# EAGLE board Mem Switch V1.0 (EAGLE 9.6.2)
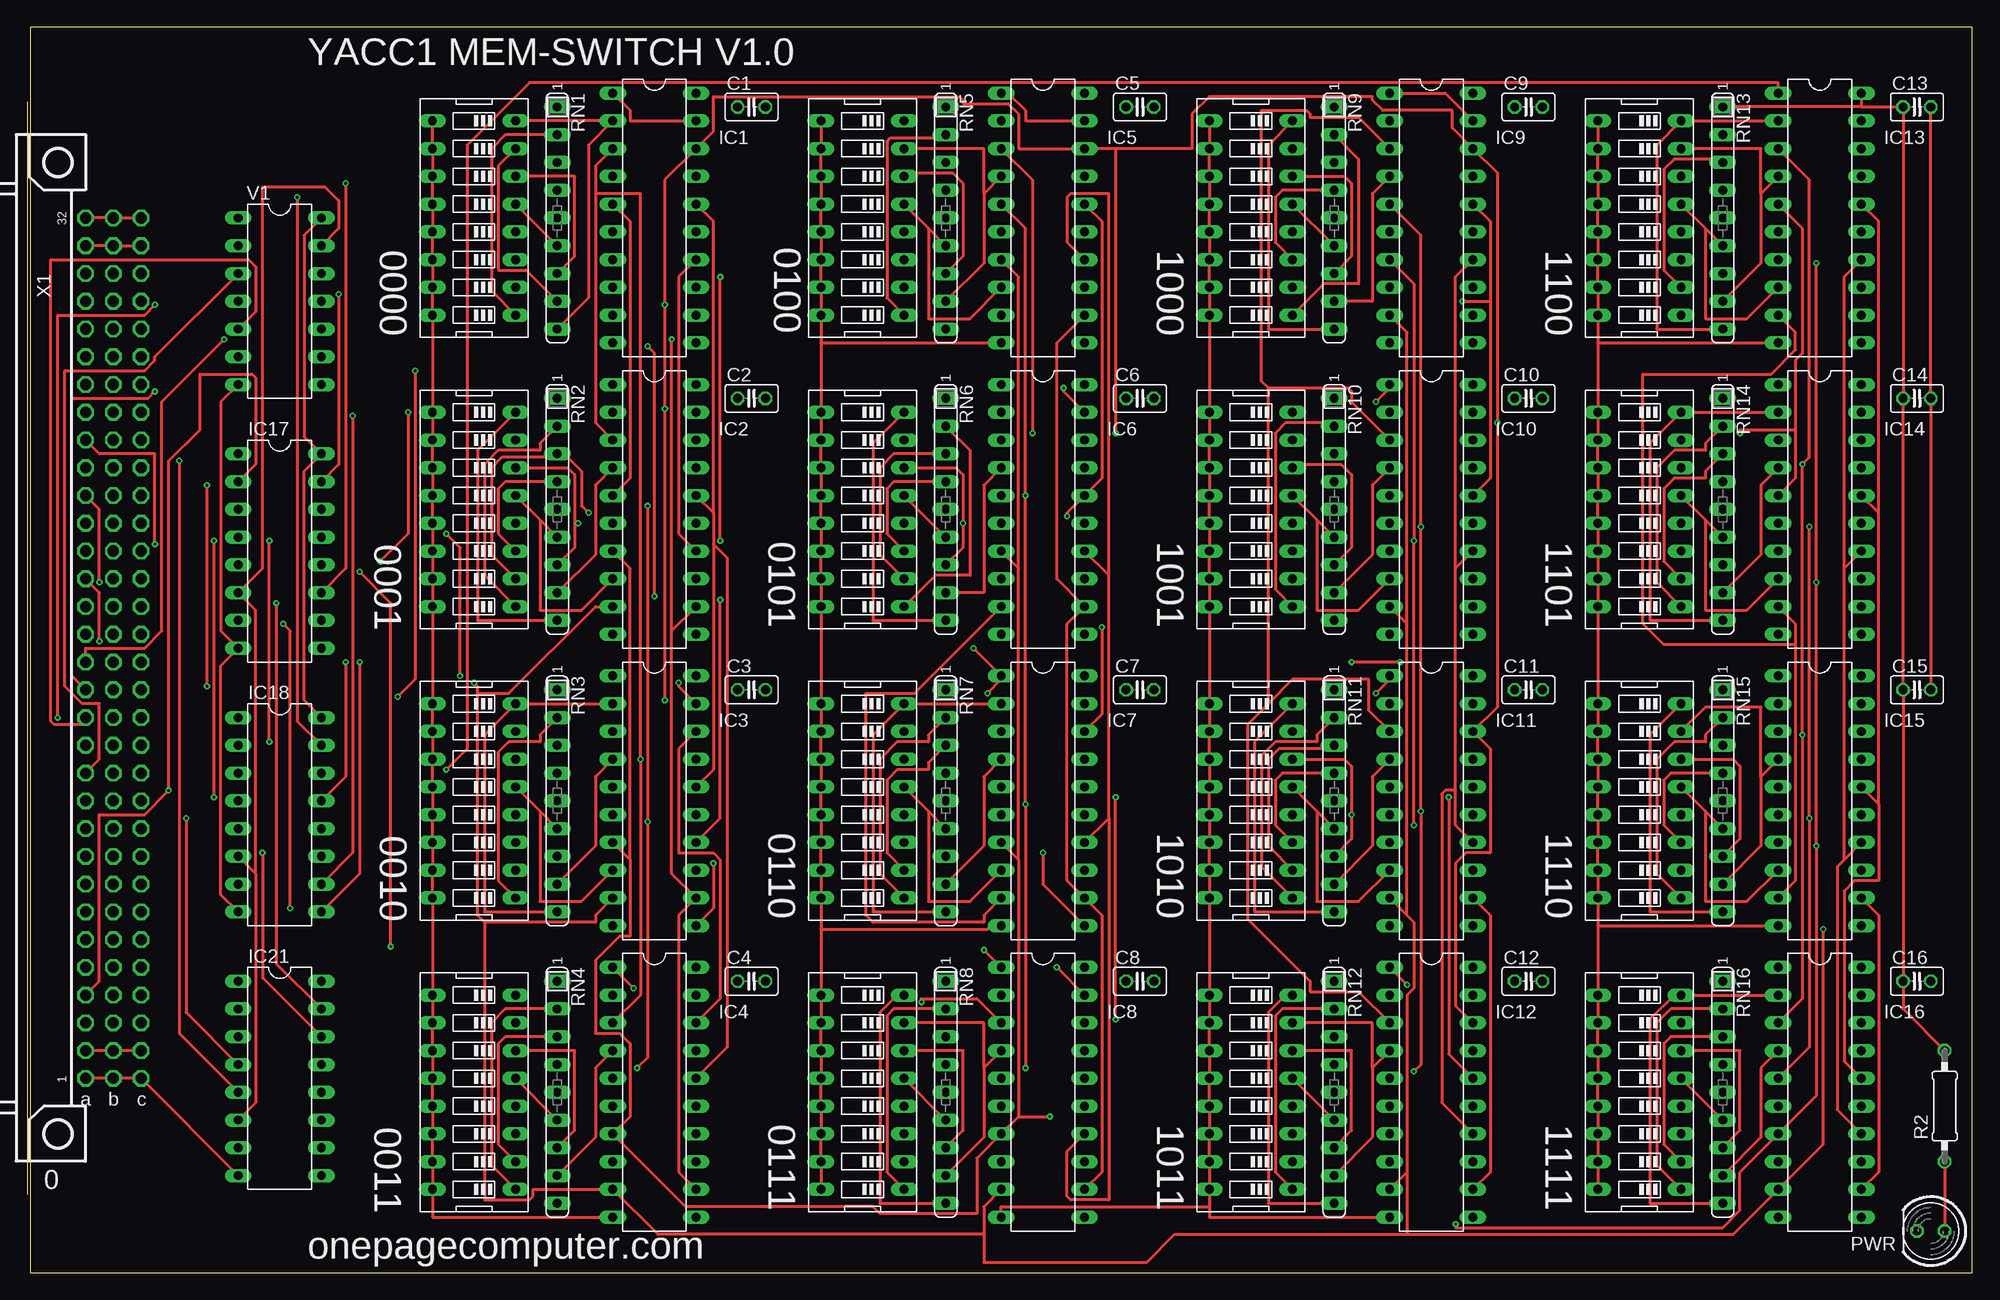
[diagram p3: board, top side]
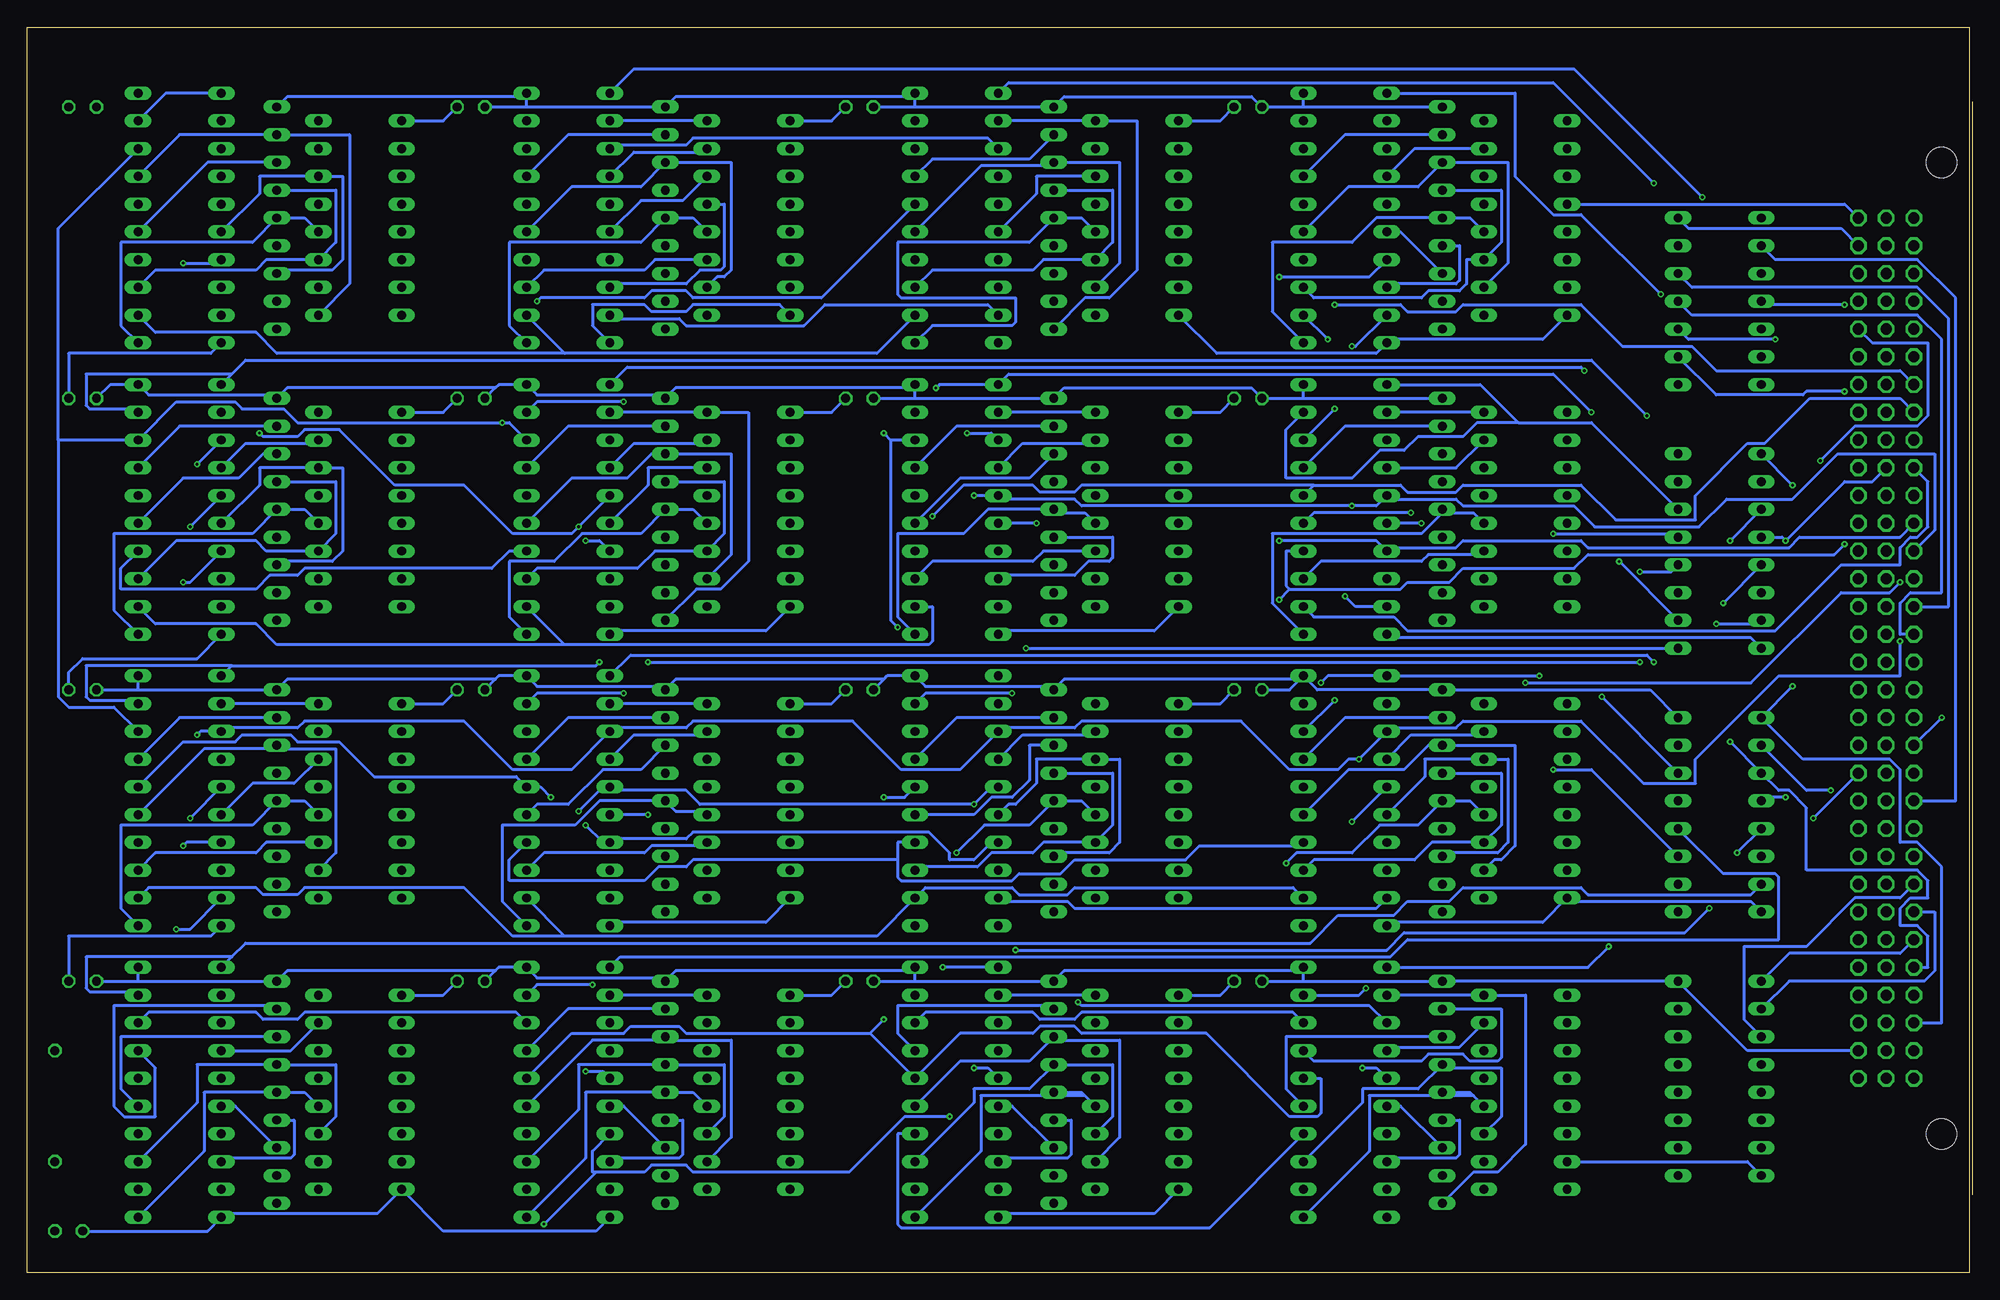
[diagram p4: board, bottom side, seen from below]

Size 177.78 x 113.97 mm. Coordinates in mm from the lower left corner, seen from the top.
Outline: 0,0 177.78,0 177.78,113.97 0,113.97 0,0
Copper layers (1*16): Top 0.035559375mm / dielectric 1.6mm / Bottom 0.035559375mm
Design rules "oshpark-2layer-auto-routing": minimum track width 10mil, minimum drill 10mil, track to track 10mil, track to pad 8mil, pad to pad 8mil, via to via 8mil, smd to smd 6mil, copper to edge 15mil, drill to drill 6mil, minimum pad ring 6mil, minimum via ring 6mil, stop-mask expansion 2.5mil, vias tented up to drill 0mil, thermal gap 10mil
Net classes: 1 GND: width 1 mm; 2 5V: width 1 mm

## Footprints (pad centres in the part's own frame; a part is rotated, then mirrored left to right if it is on the bottom)
EDG-08 = drill 0.813 long: 1 -8.89,-3.81; 2 -6.35,-3.81; 3 -3.81,-3.81; 4 -1.27,-3.81; 5 1.27,-3.81; 6 3.81,-3.81; 7 6.35,-3.81; 8 8.89,-3.81; 9 8.89,3.81; 10 6.35,3.81; 11 3.81,3.81; 12 1.27,3.81; 13 -1.27,3.81; 14 -3.81,3.81; 15 -6.35,3.81; 16 -8.89,3.81
C025-025X050 = drill 0.813 octagon: 1 -1.27,0; 2 1.27,0
DIL20 = drill 0.813 long: 1 -11.43,-3.81; 2 -8.89,-3.81; 3 -6.35,-3.81; 4 -3.81,-3.81; 5 -1.27,-3.81; 6 1.27,-3.81; 7 3.81,-3.81; 8 6.35,-3.81; 9 8.89,-3.81; 10 11.43,-3.81; 11 11.43,3.81; 12 8.89,3.81; 13 6.35,3.81; 14 3.81,3.81; 15 1.27,3.81; 16 -1.27,3.81; 17 -3.81,3.81; 18 -6.35,3.81; 19 -8.89,3.81; 20 -11.43,3.81
DIL16 = drill 0.813 long: 1 -8.89,-3.81; 2 -6.35,-3.81; 3 -3.81,-3.81; 4 -1.27,-3.81; 5 1.27,-3.81; 6 3.81,-3.81; 7 6.35,-3.81; 8 8.89,-3.81; 9 8.89,3.81; 10 6.35,3.81; 11 3.81,3.81; 12 1.27,3.81; 13 -1.27,3.81; 14 -3.81,3.81; 15 -6.35,3.81; 16 -8.89,3.81
LED5MM = drill 0.813 octagon: A -1.27,0; K 1.27,0
0207/10 = drill 0.813 octagon: 1 -5.08,0; 2 5.08,0
SIL9 = drill 0.813 long: 1 -10.16,0; 2 -7.62,0; 3 -5.08,0; 4 -2.54,0; 5 0,0; 6 2.54,0; 7 5.08,0; 8 7.62,0; 9 10.16,0
DIL14 = drill 0.813 long: 1 -7.62,-3.81; 2 -5.08,-3.81; 3 -2.54,-3.81; 4 0,-3.81; 5 2.54,-3.81; 6 5.08,-3.81; 7 7.62,-3.81; 8 7.62,3.81; 9 5.08,3.81; 10 2.54,3.81; 11 0,3.81; 12 -2.54,3.81; 13 -5.08,3.81; 14 -7.62,3.81
FABC96R = drill 1.016 octagon: A1 -2.54,39.37; A2 -2.54,36.83; A3 -2.54,34.29; A4 -2.54,31.75; A5 -2.54,29.21; A6 -2.54,26.67; A7 -2.54,24.13; A8 -2.54,21.59; A9 -2.54,19.05; A10 -2.54,16.51; A11 -2.54,13.97; A12 -2.54,11.43; A13 -2.54,8.89; A14 -2.54,6.35; A15 -2.54,3.81; A16 -2.54,1.27; A17 -2.54,-1.27; A18 -2.54,-3.81; A19 -2.54,-6.35; A20 -2.54,-8.89; A21 -2.54,-11.43; A22 -2.54,-13.97; A23 -2.54,-16.51; A24 -2.54,-19.05; A25 -2.54,-21.59; A26 -2.54,-24.13; A27 -2.54,-26.67; A28 -2.54,-29.21; A29 -2.54,-31.75; A30 -2.54,-34.29; A31 -2.54,-36.83; A32 -2.54,-39.37; B1 -5.08,39.37; B2 -5.08,36.83; B3 -5.08,34.29; B4 -5.08,31.75; B5 -5.08,29.21; B6 -5.08,26.67; B7 -5.08,24.13; B8 -5.08,21.59; B9 -5.08,19.05; B10 -5.08,16.51; B11 -5.08,13.97; B12 -5.08,11.43; B13 -5.08,8.89; B14 -5.08,6.35; B15 -5.08,3.81; B16 -5.08,1.27; B17 -5.08,-1.27; B18 -5.08,-3.81; B19 -5.08,-6.35; B20 -5.08,-8.89; B21 -5.08,-11.43; B22 -5.08,-13.97; B23 -5.08,-16.51; B24 -5.08,-19.05; B25 -5.08,-21.59; B26 -5.08,-24.13; B27 -5.08,-26.67; B28 -5.08,-29.21; B29 -5.08,-31.75; B30 -5.08,-34.29; B31 -5.08,-36.83; B32 -5.08,-39.37; C1 -7.62,39.37; C2 -7.62,36.83; C3 -7.62,34.29; C4 -7.62,31.75; C5 -7.62,29.21; C6 -7.62,26.67; C7 -7.62,24.13; C8 -7.62,21.59; C9 -7.62,19.05; C10 -7.62,16.51; C11 -7.62,13.97; C12 -7.62,11.43; C13 -7.62,8.89; C14 -7.62,6.35; C15 -7.62,3.81; C16 -7.62,1.27; C17 -7.62,-1.27; C18 -7.62,-3.81; C19 -7.62,-6.35; C20 -7.62,-8.89; C21 -7.62,-11.43; C22 -7.62,-13.97; C23 -7.62,-16.51; C24 -7.62,-19.05; C25 -7.62,-21.59; C26 -7.62,-24.13; C27 -7.62,-26.67; C28 -7.62,-29.21; C29 -7.62,-31.75; C30 -7.62,-34.29; C31 -7.62,-36.83; C32 -7.62,-39.37 | hole 2.794: 0,-44.456; 0,44.456

## Placement (x,y rotation side)
0000  [EDG-08]  40.64,96.52 90 top
0001  [EDG-08]  40.64,69.85 90 top
0010  [EDG-08]  40.64,43.18 90 top
0011  [EDG-08]  40.64,16.51 90 top
0100  [EDG-08]  76.2,96.52 90 top
0101  [EDG-08]  76.2,69.85 90 top
0110  [EDG-08]  76.2,43.18 90 top
0111  [EDG-08]  76.2,16.51 90 top
1000  [EDG-08]  111.76,96.52 90 top
1001  [EDG-08]  111.76,69.85 90 top
1010  [EDG-08]  111.76,43.18 90 top
1011  [EDG-08]  111.76,16.51 90 top
1100  [EDG-08]  147.32,96.52 90 top
1101  [EDG-08]  147.32,69.85 90 top
1110  [EDG-08]  147.32,43.18 90 top
1111  [EDG-08]  147.32,16.51 90 top
C1  [C025-025X050]  66.04,106.68 0 top
C2  [C025-025X050]  66.04,80.01 0 top
C3  [C025-025X050]  66.04,53.34 0 top
C4  [C025-025X050]  66.04,26.67 0 top
C5  [C025-025X050]  101.6,106.68 0 top
C6  [C025-025X050]  101.6,80.01 0 top
C7  [C025-025X050]  101.6,53.34 0 top
C8  [C025-025X050]  101.6,26.67 0 top
C9  [C025-025X050]  137.16,106.68 0 top
C10  [C025-025X050]  137.16,80.01 0 top
C11  [C025-025X050]  137.16,53.34 0 top
C12  [C025-025X050]  137.16,26.67 0 top
C13  [C025-025X050]  172.72,106.68 0 top
C14  [C025-025X050]  172.72,80.01 0 top
C15  [C025-025X050]  172.72,53.34 0 top
C16  [C025-025X050]  172.72,26.67 0 top
IC1  74LS244N  [DIL20]  57.15,96.52 270 top
IC2  74LS244N  [DIL20]  57.15,69.85 270 top
IC3  74LS244N  [DIL20]  57.15,43.18 270 top
IC4  74LS244N  [DIL20]  57.15,16.51 270 top
IC5  74LS244N  [DIL20]  92.71,96.52 270 top
IC6  74LS244N  [DIL20]  92.71,69.85 270 top
IC7  74LS244N  [DIL20]  92.71,43.18 270 top
IC8  74LS244N  [DIL20]  92.71,16.51 270 top
IC9  74LS244N  [DIL20]  128.27,96.52 270 top
IC10  74LS244N  [DIL20]  128.27,69.85 270 top
IC11  74LS244N  [DIL20]  128.27,43.18 270 top
IC12  74LS244N  [DIL20]  128.27,16.51 270 top
IC13  74LS244N  [DIL20]  163.83,96.52 270 top
IC14  74LS244N  [DIL20]  163.83,69.85 270 top
IC15  74LS244N  [DIL20]  163.83,43.18 270 top
IC16  74LS244N  [DIL20]  163.83,16.51 270 top
IC17  74LS138N  [DIL16]  22.86,66.04 270 top
IC18  74LS138N  [DIL16]  22.86,41.91 270 top
IC21  74LS138N  [DIL16]  22.86,17.78 270 top
PWR  [LED5MM]  173.99,3.81 180 top
R2  330  [0207/10]  175.26,15.24 90 top
RN1  [SIL9]  48.26,96.52 270 top
RN2  [SIL9]  48.26,69.85 270 top
RN3  [SIL9]  48.26,43.18 270 top
RN4  [SIL9]  48.26,16.51 270 top
RN5  [SIL9]  83.82,96.52 270 top
RN6  [SIL9]  83.82,69.85 270 top
RN7  [SIL9]  83.82,43.18 270 top
RN8  [SIL9]  83.82,16.51 270 top
RN9  [SIL9]  119.38,96.52 270 top
RN10  [SIL9]  119.38,69.85 270 top
RN11  [SIL9]  119.38,43.18 270 top
RN12  [SIL9]  119.38,16.51 270 top
RN13  [SIL9]  154.94,96.52 270 top
RN14  [SIL9]  154.94,69.85 270 top
RN15  [SIL9]  154.94,43.18 270 top
RN16  [SIL9]  154.94,16.51 270 top
V1  744078N  [DIL14]  22.86,88.9 270 top
X1  FABC96R  [FABC96R]  2.54,57.15 180 top

## Tracks (layer width: path | path; a pad name or v marks a point on that pad's centre or on a via)
-BUS-EN  (via drill 0.25)
  Top 0.254: IC21.5 13.65,21.91 v13.65,74.3
  Bottom 0.254: v13.65,74.3 10.48,77.47 4.76,77.47 3.81,78.42 3.81,85.09 8.89,85.09 X1.C28
-MEM-RD  (via drill 0.25)
  Top 0.254: v16.83,66.99 v16.83,43.5
  Bottom 0.254: IC18.4 18.73,43.5 v16.83,43.5 | IC17.4 17.14,67.31 v16.83,66.99 11.43,72.39 8.89,72.39 X1.B23
-VMA  (via drill 0.25)
  Top 0.254: IC21.4 14.29,23.81 v14.29,41.59
  Bottom 0.254: X1.C12 v14.29,41.59
ADDR0  (via drill 0.25)
  Top 0.254: v16.19,53.66 v16.19,72.07
  Bottom 0.254: X1.A3 2.54,22.86 2.54,37.15 4.76,39.37 6.35,39.37 6.35,46.04 7.3,46.99 15.24,46.99 IC18.1 v16.19,53.66 | v16.19,72.07 IC17.1
ADDR1  (via drill 0.25)
  Top 0.254: X1.A4 6.35,26.67 6.35,41.91 10.48,41.91 v12.7,44.13 12.7,74.3 15.56,77.15 15.56,82.23 20.32,82.23 20.64,81.92 20.64,73.98 IC17.2
  Bottom 0.254: IC18.2 14.92,44.13 v12.7,44.13
ADDR2  (via drill 0.25)
  Top 0.254: v21.91,48.58 v21.91,66.99
  Bottom 0.254: X1.A5 3.81,27.94 3.81,30.8 4.76,31.75 6.35,31.75 6.35,33.34 5.4,34.29 3.81,34.29 3.81,35.88 4.76,36.83 14.92,36.83 14.92,42.55 16.51,44.13 17.46,44.13 IC18.3 v21.91,48.58 | v21.91,66.99 IC17.3
ADDR3
  Bottom 0.254: IC21.1 16.51,29.21 6.35,29.21 X1.A6
ADDR4
  Bottom 0.254: IC21.2 16.51,26.67 4.13,26.67 3.17,27.62 3.17,33.02 X1.A7
ADDR5
  Bottom 0.254: IC21.3 20.64,23.18 20.64,29.84 14.92,29.84 10.48,34.29 6.35,34.29 X1.A8
ADDR8
  Bottom 0.254: V1.2 17.78,92.71 4.76,92.71 1.27,89.22 1.27,43.18 X1.A11
ADDR9
  Top 0.254: V1.3 11.43,83.82 11.43,83.5 10.48,82.55 3.17,82.55 3.17,53.66 4.76,52.07 6.35,52.07 6.35,46.99 X1.A12
ADDR10  (via drill 0.25)
  Top 0.254: v11.43,88.58 10.48,87.63 2.54,87.63 v2.54,50.8
  Bottom 0.254: V1.4 18.73,88.58 v11.43,88.58 | X1.A13 v2.54,50.8
ADDR11
  Top 0.254: V1.5 20.64,87.95 20.64,92.08 20,92.71 1.91,92.71 1.91,50.48 2.22,50.16 5.08,50.16 X1.A14
ADDR12  (via drill 0.25)
  Top 0.254: v11.43,80.64 10.79,80.01 3.81,80.01 3.81,54.61 X1.A15
  Bottom 0.254: V1.9 23.18,80.33 15.24,80.33 14.92,80.64 v11.43,80.64
ADDR13  (via drill 0.25)
  Top 0.254: v17.78,85.41 12.06,79.69 12.06,58.74 10.48,57.15 5.08,57.15 X1.A16
  Bottom 0.254: V1.10 25.72,85.41 v17.78,85.41
ADDR14
  Bottom 0.254: V1.11 25.4,87.63 4.76,87.63 2.54,85.41 2.54,62.23 5.4,62.23 6.35,61.28 6.35,58.42 X1.A17
ADDR15
  Bottom 0.254: V1.12 25.4,90.17 4.76,90.17 1.91,87.31 1.91,60.96 X1.A18
DATA0  (via drill 0.25)
  Top 0.254: IC16.3 162.24,25.08 v162.24,49.21 v162.24,73.98 162.88,74.61 162.88,100.01 IC13.3 | v91.76,76.83 91.76,100.01 IC5.3 | IC12.3 121.6,25.72 117.16,25.72 117.16,26.67 111.44,32.38 111.44,50.16 113.35,52.07 | 113.35,52.07 115.57,54.29 122.56,54.29 122.56,51.44 IC11.3 | IC10.3 120.97,79.69 120.97,80.64 120.65,80.96 113.35,80.96 | 113.35,52.07 113.35,80.96 | IC9.3 121.6,105.73 117.16,105.73 117.16,106.05 116.84,106.36 112.71,106.36 112.71,81.6 113.35,80.96 | IC2.3 51.75,77.79 51.75,98.74 | 51.75,98.74 51.75,101.28 IC1.3 | IC4.3 55.88,25.4 v55.88,46.99 55.88,98.74 51.75,98.74 | IC8.3 86.68,25.08 81.6,25.08 v81.6,24.77 | X1.A19 6.35,62.23 v6.35,57.78
  Bottom 0.254: v162.24,49.21 161.93,49.53 IC15.3 159.7,49.85 153.03,49.85 152.4,50.48 137.79,50.48 133.35,46.04 127.95,46.04 IC11.3 124.14,49.85 117.47,49.85 116.84,50.48 102.23,50.48 97.79,46.04 92.39,46.04 IC7.3 88.58,49.85 81.92,49.85 81.28,50.48 66.67,50.48 62.23,46.04 57.78,46.04 56.83,46.99 v55.88,46.99 IC3.3 53.02,49.85 46.99,49.85 46.35,50.48 35.56,50.48 29.84,44.77 25.08,44.77 25.08,46.99 17.46,54.61 6.35,54.61 v6.35,57.78 | v162.24,73.98 IC14.3 | IC6.3 89.53,76.83 v91.76,76.83 | IC9.3 124.14,103.19 117.47,103.19 116.84,103.82 89.85,103.82 IC5.3 | v81.6,24.77 81.28,24.45 54.93,24.45 IC4.3
DATA1  (via drill 0.25)
  Top 0.254: IC14.5 161.61,72.71 161.61,77.15 | 161.61,77.15 161.61,83.5 162.24,84.14 162.24,95.57 IC13.5 | IC16.5 162.88,20.64 v162.88,41.59 v162.88,68.26 | v126.68,18.41 127.32,19.05 v127.32,42.23 v127.32,68.26 127.32,94.93 IC9.5 | v91.12,18.73 v91.12,42.86 v91.12,71.12 91.12,95.57 IC5.5 | v55.56,18.73 56.52,19.68 v56.52,41.27 v56.52,70.17 | IC2.5 54.93,72.71 54.93,96.2 IC1.5 | 161.61,77.15 156.53,77.15 v156.53,76.83
  Bottom 0.254: IC15.5 v162.88,41.59 | v162.88,68.26 IC14.5 | IC12.5 125.09,18.41 v126.68,18.41 | v127.32,42.23 125.09,44.45 IC11.5 124.14,44.13 117.47,44.13 116.2,42.86 v91.12,42.86 89.53,44.45 IC7.5 | IC10.5 v127.32,68.26 127.95,67.63 133.35,67.63 137.79,72.07 144.15,72.07 149.22,77.15 152.4,77.15 153.03,76.52 156.21,76.52 v156.53,76.83 | IC8.5 89.85,18.73 v91.12,18.73 | IC4.5 54.29,18.73 v55.56,18.73 | IC3.5 v56.52,41.27 | 53.66,70.8 54.29,70.17 v56.52,70.17 81.28,70.17 81.92,70.8 88.58,70.8 IC6.5 v91.12,71.12 | X1.A20 3.17,67.94 3.17,74.93 12.06,74.93 16.19,70.8 22.23,70.8 24.77,68.26 34.29,68.26 36.2,70.17 46.35,70.17 46.99,70.8 53.66,70.8 | 53.66,70.8 IC2.5
DATA2  (via drill 0.25)
  Top 0.254: 54.93,37.78 54.93,30.8 53.98,30.8 51.75,28.57 51.75,21.91 53.98,21.91 54.93,20.95 54.93,14.29 IC4.7 60.01,6.03 77.15,6.03 77.79,5.4 86.68,5.4 86.68,10.48 IC8.7 90.49,14.29 | IC3.7 54.93,37.78 | IC2.7 54.93,64.45 54.93,37.78 | v63.18,66.99 v63.18,91.12 | v163.51,92.39 v163.51,63.18 v163.51,39.05 163.51,16.19 IC16.7 156.53,9.21 156.53,5.71 154.94,4.13 130.49,4.13 v130.49,4.45 | IC9.7 126.68,90.49 v126.68,66.99 v126.68,40.96 | 90.49,37.78 90.49,14.29 | IC7.7 90.49,37.78 | 90.49,14.29 v93.34,14.29 | 90.49,64.45 IC6.7 | 90.49,37.78 90.49,64.45 | IC5.7 90.49,91.12 90.49,64.45
  Bottom 0.254: IC1.7 54.93,91.12 v63.18,91.12 | v63.18,66.99 54.29,66.99 53.66,66.36 | X1.A21 6.35,67.31 15.56,67.31 16.51,66.36 34.92,66.36 35.56,66.99 46.35,66.99 46.99,66.36 53.66,66.36 | 53.66,66.36 IC2.7 | v163.51,39.05 163.19,39.37 IC15.7 | IC14.7 162.88,63.18 v163.51,63.18 | IC13.7 160.34,92.39 v163.51,92.39 | IC10.7 125.41,66.99 v126.68,66.99 | IC12.7 126.05,11.11 126.05,9.21 125.73,9.21 | 125.73,9.21 121.28,9.21 120.65,9.84 117.47,9.84 116.84,9.21 102.55,9.21 97.47,14.29 v93.34,14.29 | IC7.7 89.53,39.37 91.12,37.78 93.34,37.78 93.34,38.42 95.25,40.32 116.84,40.32 117.47,39.69 124.14,39.69 IC11.7 125.09,39.37 v126.68,40.96 | 125.73,9.21 v130.49,4.45
DATA3  (via drill 0.25)
  Top 0.254: IC15.9 161.61,35.88 161.61,57.47 | 161.61,57.47 161.61,59.37 IC14.9 | IC13.9 161.61,86.04 161.61,84.45 159.38,82.23 147.64,82.23 147.64,59.37 149.54,57.47 161.61,57.47 | 126.05,9.21 IC12.9 | 126.05,9.21 126.05,25.4 126.68,26.04 126.68,32.07 126.05,32.7 | IC11.9 126.05,32.7 | 126.05,3.49 155.89,3.49 IC16.9 164.15,11.75 v164.15,31.43 | 126.05,9.21 126.05,3.49 | 126.05,59.37 IC10.9 | 126.05,32.7 126.05,59.37 | IC9.9 126.05,86.04 126.05,59.37 | 87.31,3.49 57.47,3.49 IC4.9 46.04,7.62 46.04,6.99 45.72,6.67 41.59,6.67 41.59,32.07 | 87.31,3.49 87.31,6.03 IC8.9 | IC2.9 51.75,60.96 43.81,53.02 40.96,53.02 | 40.96,53.02 40.96,32.7 41.59,32.07 | 41.59,32.07 51.75,32.07 51.75,32.7 IC3.9 | IC6.9 80.96,53.02 76.52,53.02 76.52,32.7 77.15,32.07 87.31,32.07 87.31,32.7 IC7.9 | v56.52,84.77 57.15,84.14 v57.15,61.91 | X1.A22 6.35,69.85 v6.35,63.18 | v40.64,53.98 40.96,53.66 40.96,53.02 | 126.05,3.49 104.78,3.49 102.23,0.95 87.31,0.95 87.31,3.49
  Bottom 0.254: IC5.9 89.85,88.58 104.78,88.58 106.68,86.68 117.47,86.68 118.11,87.31 124.14,87.31 IC9.9 | IC15.9 162.88,31.43 v164.15,31.43 | IC3.9 54.29,33.34 81.92,33.34 82.55,33.97 88.58,33.97 IC7.9 | IC1.9 56.2,84.77 v56.52,84.77 | v57.15,61.91 56.2,60.96 IC2.9 | v6.35,63.18 7.3,62.23 11.75,62.23 20,53.98 v40.64,53.98
DATA4  (via drill 0.25)
  Top 0.254: IC4.12 59.37,9.21 59.37,32.7 IC3.12 58.74,36.51 58.74,58.74 | 58.74,58.74 IC2.12 | 58.74,58.74 v58.74,85.41 | IC16.12 169.23,9.21 169.23,32.7 IC15.12 | IC12.12 133.67,9.21 133.67,32.7 IC11.12 | IC8.12 98.11,9.21 98.11,32.7 IC7.12 94.93,35.88 94.93,59.37 IC6.12 93.98,63.5 93.98,85.09 IC5.12
  Bottom 0.254: v58.74,85.41 IC1.12 | X1.A23 3.81,72.39 3.81,68.26 4.76,67.31 5.4,67.31 6.35,66.36 6.35,64.77 11.75,64.77 17.78,58.74 51.44,58.74 52.7,60.01 60.01,60.01 IC2.12 | 128.59,57.47 IC10.12 | 128.59,57.47 95.25,57.47 94.93,57.78 94.93,60.96 IC6.12 | 128.59,84.14 IC9.12 | 128.59,84.14 100.01,84.14 IC5.12 | IC14.12 166.05,59.37 156.84,59.37 154.94,57.47 128.59,57.47 | IC13.12 166.05,86.04 156.84,86.04 154.94,84.14 128.59,84.14 | 128.59,30.8 IC11.12 | 128.59,30.8 100.01,30.8 IC7.12 95.57,35.24 87.63,35.24 87,34.61 82.55,34.61 81.92,35.24 61.91,35.24 IC3.12 | IC15.12 166.69,35.24 156.84,35.24 156.21,34.61 153.03,34.61 152.4,35.24 137.79,35.24 133.35,30.8 128.59,30.8
DATA5  (via drill 0.25)
  Top 0.254: IC16.14 165.42,14.92 165.42,37.15 166.05,37.78 | IC15.14 166.05,37.78 | 166.05,64.45 IC14.14 | 166.05,37.78 166.05,64.45 | IC13.14 166.05,91.12 166.05,64.45 | IC12.14 129.22,15.56 129.22,43.81 129.54,44.13 130.49,44.13 | 130.49,44.13 130.49,40.96 IC11.14 | 130.49,64.45 IC10.14 | 130.49,44.13 130.49,64.45 | IC9.14 130.49,91.12 130.49,64.45 | IC2.14 59.37,67.63 59.37,91.12 IC1.14 | X1.A24 6.35,74.93 11.43,74.93 v11.43,66.67 | 98.74,63.82 IC6.14 | 98.74,41.59 98.74,63.82 | IC7.14 98.74,41.59 | IC5.14 94.93,94.3 94.93,98.42 95.25,98.74 98.74,98.74 98.74,63.82 | IC8.14 94.93,11.11 94.93,6.99 95.25,6.67 98.74,6.67 98.74,41.59 | v63.18,61.59 63.18,41.59 IC3.14
  Bottom 0.254: IC14.14 169.23,64.45 169.23,62.55 156.84,62.55 155.57,63.82 153.03,63.82 152.4,64.45 135.25,64.45 133.67,66.04 IC10.14 | v11.43,66.67 12.38,65.72 34.92,65.72 36.2,64.45 46.35,64.45 47.62,63.18 51.44,63.18 52.07,62.55 62.23,62.55 | 62.23,62.55 62.55,62.87 62.55,66.04 IC2.14 | IC4.14 69.53,4.13 97.79,4.13 98.11,4.45 98.11,12.7 IC8.14 | IC3.14 61.28,39.05 70.48,39.05 71.75,37.78 81.92,37.78 83.19,36.51 87,36.51 87.63,35.88 97.79,35.88 98.11,36.2 98.11,37.78 | 98.11,37.78 98.11,39.37 IC7.14 | v63.18,61.59 62.23,62.55 | IC11.14 133.67,37.78 133.67,35.88 121.28,35.88 120.02,37.15 117.47,37.15 116.84,37.78 98.11,37.78
DATA6  (via drill 0.25)
  Top 0.254: v99.38,23.18 v99.38,43.5 | IC16.16 166.05,19.37 166.05,34.92 167,35.88 169.23,35.88 169.23,42.86 | IC15.16 169.23,42.86 | 169.23,69.53 IC14.16 | 169.23,42.86 169.23,69.53 | IC13.16 169.23,96.2 169.23,69.53 | IC12.16 129.86,20 v129.86,43.5 | IC10.16 133.67,72.71 133.67,88.9 | 133.67,88.9 133.67,96.2 IC9.16 | IC5.16 98.11,96.2 98.11,72.71 IC6.16 94.93,69.53 v94.93,69.22 | IC4.16 63.82,20.64 63.82,65.41 62.55,66.67 | 62.55,69.53 62.55,66.67 | IC2.16 62.55,69.53 | IC3.16 62.55,46.04 62.55,66.67 | IC1.16 62.55,96.2 62.55,69.53 | v131.13,88.9 133.67,88.9
  Bottom 0.254: 100.65,21.91 IC8.16 92.39,21.91 85.72,21.91 85.09,22.54 81.92,22.54 81.28,21.91 69.85,21.91 62.23,14.29 59.69,14.29 59.37,14.61 59.37,17.78 IC4.16 | 100.65,21.91 117.47,21.91 118.11,22.54 122.56,22.54 123.19,21.91 127.95,21.91 IC12.16 | IC7.16 97.47,43.5 v99.38,43.5 | 100.65,21.91 v99.38,23.18 | IC15.16 163.51,48.58 158.75,48.58 158.12,49.21 153.67,49.21 153.03,48.58 149.22,48.58 146.05,45.4 133.03,45.4 IC11.16 130.81,44.45 v129.86,43.5 | X1.A25 6.35,80.01 14.61,80.01 18.73,75.88 20.32,75.88 25.08,71.12 25.08,68.9 32.38,68.9 35.56,72.07 46.35,72.07 46.99,71.44 51.44,71.44 52.07,72.07 60.01,72.07 | IC2.16 60.01,72.07 | v94.93,69.22 92.08,72.07 85.72,72.07 85.09,71.44 81.92,71.44 81.28,72.07 60.01,72.07 | v131.13,88.9 130.81,89.22 121.28,89.22 120.65,89.85 117.47,89.85 116.84,89.22 105.09,89.22 IC5.16
DATA7  (via drill 0.25)
  Top 0.254: IC12.18 130.49,24.45 130.49,37.47 131.44,38.42 133.67,38.42 133.67,47.94 IC11.18 134.3,51.75 v134.3,77.79 134.3,100.65 IC9.18 130.18,104.78 130.18,106.36 123.83,106.36 122.87,107.31 122.87,107.63 107.95,107.63 106.36,106.05 106.36,102.87 99.38,102.87 | IC7.18 98.11,51.12 v98.11,59.05 | 99.38,102.87 IC5.18 90.49,102.87 90.49,106.05 89.53,107 85.41,107 85.41,107.31 85.09,107.63 62.55,107.63 62.55,104.46 IC1.18 58.1,100.01 v58.1,88.58 v58.1,79.06 v58.1,52.39 | 99.38,102.87 v99.38,76.83 | IC4.18 63.18,25.08 63.18,37.78 62.55,38.42 59.37,38.42 59.37,47.94 IC3.18
  Bottom 0.254: IC10.18 133.67,77.79 v134.3,77.79 153.03,77.79 154.31,79.06 158.12,79.06 158.75,79.69 164.15,79.69 IC14.18 174.94,76.2 | IC15.18 169.86,51.75 173.99,51.75 174.94,52.7 174.94,76.2 | IC13.18 174.94,95.57 174.94,76.2 | IC16.18 166.69,23.81 156.84,23.81 156.21,23.18 153.03,23.18 152.4,23.81 133.03,23.81 IC12.18 | v98.11,59.05 98.74,59.69 98.74,76.2 | IC6.18 98.74,76.2 | v99.38,76.83 98.74,76.2 | IC8.18 95.57,23.81 85.72,23.81 85.09,23.18 81.92,23.18 81.28,23.81 61.91,23.81 IC4.18 | v58.1,79.06 IC2.18 | X1.A26 6.35,82.55 23.18,82.55 25.4,84.77 31.75,84.77 35.56,88.58 46.35,88.58 46.99,87.95 51.44,87.95 52.07,88.58 v58.1,88.58 | v58.1,52.39 IC3.18
GND
  Top 0.254: 1111.16 1111.15 1111.14 1111.13 1111.12 1111.11 1111.10 1111.9 143.51,31.75 | 143.51,31.75 IC15.10 | 143.51,31.75 1110.16 1110.15 1110.14 1110.13 1110.12 1110.11 1110.10 1110.9 1101.16 1101.15 1101.14 1101.13 1101.12 1101.11 1101.10 1101.9 143.51,85.09 | 1100.9 1100.10 1100.11 1100.12 1100.13 1100.14 1100.15 1100.16 143.51,85.09 | 143.51,85.09 IC13.10 | C13.2 C14.2 C15.2 | IC12.10 107.95,5.08 107.95,6.03 | 107.95,6.03 1011.16 1011.15 1011.14 1011.13 1011.12 1011.11 1011.10 1011.9 1010.16 1010.15 1010.14 1010.13 1010.12 1010.11 1010.10 1010.9 1001.16 1001.15 1001.14 1001.13 1001.12 1001.11 1001.10 1001.9 1000.16 1000.15 1000.14 1000.13 1000.12 1000.11 1000.10 1000.9 | 0111.16 0111.15 0111.14 0111.13 0111.12 0111.11 0111.10 0111.9 72.39,31.43 | IC7.10 87.95,31.75 87.63,31.43 72.39,31.43 | 72.39,31.43 0110.16 0110.15 0110.14 0110.13 0110.12 0110.11 0110.10 0110.9 0101.16 0101.15 0101.14 0101.13 0101.12 0101.11 0101.10 0101.9 72.39,85.09 | 0100.9 0100.10 0100.11 0100.12 0100.13 0100.14 0100.15 0100.16 72.39,85.09 | 72.39,85.09 IC5.10 | X1.A1 X1.B1 X1.C1 IC21.8 | IC4.10 36.83,5.08 0011.16 0011.15 0011.14 0011.13 0011.12 0011.11 0011.10 0011.9 0010.16 0010.15 0010.14 0010.13 0010.12 0010.11 0010.10 0010.9 0001.16 0001.15 0001.14 0001.13 0001.12 0001.11 0001.10 0001.9 0000.16 0000.15 0000.14 0000.13 0000.12 0000.11 0000.10 0000.9 | V1.7 17.46,79.69 17.46,58.74 IC17.8 17.46,55.56 17.46,34.61 IC18.8 | X1.A32 X1.B32 X1.C32 | 107.95,6.03 88.9,6.03 IC8.10
  Bottom 0.254: PWR.K 161.29,3.81 IC16.10 159.7,5.4 145.73,5.4 1111.16 139.7,3.81 125.73,3.81 IC12.10 | C12.2 139.7,25.4 1111.9 | C11.2 139.7,52.07 1110.9 | C16.2 173.99,30.8 160.97,30.8 IC15.10 | C10.2 139.7,78.74 1101.9 | IC14.10 162.24,56.2 172.72,56.2 173.99,54.93 C15.2 | C9.2 139.7,105.41 1100.9 | C14.2 173.99,84.14 160.97,84.14 IC13.10 | C8.2 104.14,25.4 1011.9 | C7.2 104.14,52.07 1010.9 | IC11.10 124.14,32.07 110.17,32.07 1010.16 | C6.2 104.14,78.74 1001.9 | IC10.10 124.14,58.74 110.17,58.74 1001.16 | C5.2 104.14,105.41 1000.9 | IC9.10 126.05,86.68 126.05,88.58 121.28,88.58 120.65,87.95 117.47,87.95 116.84,88.58 108.9,88.58 1000.16 | C4.2 68.58,25.4 0111.9 | IC8.10 88.58,5.4 74.61,5.4 0111.16 | C3.2 68.58,52.07 0110.9 | C2.2 68.58,78.74 0101.9 | IC6.10 88.58,58.74 74.61,58.74 0101.16 | C1.2 68.58,105.41 0100.9 | IC21.8 20.32,10.16 0011.15 | IC2.10 53.02,58.1 20,58.1 IC17.8 | IC18.8 20,33.97 36.51,33.97 0010.16 39.05,32.07 53.02,32.07 IC3.10 | 0000.16 39.05,85.41 53.02,85.41 IC1.10 54.29,84.14 68.9,84.14 0100.16 | X1.C32 11.43,97.79 0000.12
N$1
  Top 0.254: 0000.1 42.23,89.85 42.23,102.87 43.5,104.14 RN1.2
  Bottom 0.254: IC1.17 57.15,104.14 RN1.2
N$2
  Bottom 0.254: 0000.2 42.23,92.39 42.23,101.6 RN1.3 50.48,99.38 56.83,99.38 IC1.15
N$3
  Bottom 0.254: RN1.4 42.86,99.06 42.86,94.3 0000.3 46.04,92.71 46.04,90.49 46.67,89.85 49.53,89.85 50.16,89.22 60.01,89.22 IC1.13
N$4
  Bottom 0.254: 0000.4 45.72,96.52 RN1.5 54.29,96.52 56.52,94.3 63.82,94.3 63.82,87.95 IC1.11
N$5
  Top 0.254: RN1.6 0000.5
  Bottom 0.254: IC1.8 53.02,90.49 46.99,90.49 46.67,90.81 46.67,93.98 RN1.6
N$7
  Top 0.254: 0000.6 49.85,100.33 49.85,93.03 RN1.7
  Bottom 0.254: RN1.7 52.07,95.25 IC1.6
N$8
  Top 0.254: RN1.8 45.4,91.76 42.86,91.76 42.86,101.28 0000.7
  Bottom 0.254: IC1.4 50.8,102.87 0000.7
N$9
  Top 0.254: RN1.9 51.12,89.22 51.12,103.19 IC1.2 0000.8
N$10
  Top 0.254: 0001.1 41.59,63.82 41.59,73.98 42.86,75.25 46.67,75.25 46.67,75.88 RN2.2
  Bottom 0.254: IC2.17 57.15,77.47 RN2.2
N$11
  Top 0.254: R2.1 PWR.A
N$12  (via drill 0.25)
  Top 0.254: 0001.2 42.23,65.72 42.23,73.66 43.18,74.61 48.26,74.61 | v51.12,69.53 50.48,70.17 50.48,73.34 49.21,74.61 48.26,74.61 | 48.26,74.61 RN2.3
  Bottom 0.254: IC2.15 60.01,69.53 v51.12,69.53
N$13
  Top 0.254: 0001.3 42.86,67.63 42.86,71.75 43.5,72.39 RN2.4
  Bottom 0.254: IC2.13 59.37,65.09 50.16,65.09 49.53,65.72 44.77,65.72 0001.3
N$14
  Bottom 0.254: 0001.4 45.4,69.53 47.94,69.53 | IC2.11 63.82,61.28 63.82,67.63 50.16,67.63 48.26,69.53 47.94,69.53 | 47.94,69.53 RN2.5
N$15
  Top 0.254: RN2.6 46.67,68.9 | 46.67,68.9 0001.5 | IC2.8 50.48,60.64 46.67,60.64 46.67,68.9
N$16  (via drill 0.25)
  Top 0.254: RN2.7 49.85,66.36 49.85,68.58 | 49.85,68.58 49.85,73.03 49.21,73.66 0001.6 | 49.85,68.58 v50.16,68.58
  Bottom 0.254: v50.16,68.58 IC2.6
N$17
  Top 0.254: RN2.8 51.75,65.72 51.75,72.07 IC2.4
  Bottom 0.254: 0001.7 46.99,73.66 IC2.4
N$18
  Top 0.254: RN2.9 40.96,59.69 40.96,75.25 0001.8
  Bottom 0.254: 0001.8 IC2.2
N$19  (via drill 0.25)
  Top 0.254: IC21.15 22.54,28.26 v22.54,61.28
  Bottom 0.254: IC17.5 v22.54,61.28
N$20
  Top 0.254: 0010.1 42.86,35.88 42.86,47.62 43.81,48.58 46.67,48.58 46.67,49.21 RN3.2
  Bottom 0.254: IC3.17 57.15,50.8 RN3.2
N$21
  Bottom 0.254: 0010.2 43.5,37.78 42.86,37.78 41.59,39.05 41.59,48.26 RN3.3 49.53,48.26 51.75,46.04 56.83,46.04 IC3.15
N$22
  Bottom 0.254: RN3.4 42.86,45.72 42.86,40.96 0010.3 49.21,39.37 50.8,37.78 60.01,37.78 IC3.13
N$23  (via drill 0.25)
  Top 0.254: IC3.11 62.55,33.34 v62.55,37.47
  Bottom 0.254: 0010.4 45.72,43.18 RN3.5 50.48,40.96 53.98,40.96 56.52,38.42 61.59,38.42 v62.55,37.47
N$24
  Top 0.254: RN3.6 46.67,42.23 | 46.67,42.23 0010.5 | IC3.8 50.48,33.97 46.67,33.97 46.67,42.23
N$25
  Bottom 0.254: RN3.7 47.94,38.42 43.18,38.42 42.23,39.37 42.23,46.99 0010.6 49.85,46.99 49.85,45.4 IC3.6
N$26
  Top 0.254: RN3.8 51.75,39.05 51.75,45.4 IC3.4
  Bottom 0.254: 0010.7 44.77,49.21 51.12,49.21 IC3.4
N$27
  Top 0.254: RN3.9 41.59,33.02 41.59,49.21 0010.8 IC3.2
N$28  (via drill 0.25)
  Top 0.254: IC21.14 21.27,26.99 v21.27,38.42
  Bottom 0.254: IC18.5 v21.27,38.42
N$29
  Top 0.254: 0011.1 42.23,9.84 42.23,22.86 43.5,24.13 RN4.2
  Bottom 0.254: IC4.17 60.01,19.37 50.16,19.37 49.53,20 46.35,20 45.72,19.37 43.18,19.37 42.86,19.68 42.86,24.13 RN4.2
N$30
  Top 0.254: 0011.2 42.86,11.75 42.86,20.95 43.5,21.59 RN4.3
  Bottom 0.254: IC4.15 62.55,16.83 62.55,21.59 RN4.3
N$31
  Bottom 0.254: 0011.3 42.86,14.29 42.86,18.73 47.94,18.73 RN4.4 50.48,16.83 55.56,16.83 55.56,15.56 IC4.13
N$32
  Bottom 0.254: 45.4,16.19 45.72,16.51 RN4.5 | 45.4,16.19 0011.4 | IC4.11 54.93,11.11 54.93,16.19 45.4,16.19
N$33
  Top 0.254: RN4.6 0011.5
  Bottom 0.254: IC4.8 53.02,10.48 46.99,10.48 46.67,10.79 46.67,13.97 RN4.6
N$34
  Top 0.254: 0011.6 49.85,20.32 49.85,13.02 RN4.7
  Bottom 0.254: RN4.7 52.07,15.24 IC4.6
N$35
  Top 0.254: RN4.8 51.75,12.38 51.75,18.73 IC4.4
  Bottom 0.254: 0011.7 46.67,20.64 53.02,20.64 IC4.4
N$36
  Bottom 0.254: RN4.9 45.4,9.21 43.18,9.21 40.64,11.75 40.64,25.4 0011.8 IC4.2
N$37
  Top 0.254: IC21.6 20.64,15.56 20.64,36.51 | IC18.6 20.64,36.51 | 20.64,36.51 20.64,60.64 IC17.6 21.27,64.45 21.27,99.38 26.99,99.38 28.26,98.11 28.26,95.57 V1.13
N$38
  Top 0.254: 0100.1 78.42,89.22 78.42,103.5 78.74,103.82 83.82,103.82 RN5.2
  Bottom 0.254: IC5.17 94.93,101.92 86.04,101.92 RN5.2
N$39
  Bottom 0.254: 0100.2 77.79,92.39 77.79,101.6 RN5.3 84.14,101.28 90.49,101.28 IC5.15
N$40
  Bottom 0.254: RN5.4 78.42,99.06 78.42,94.3 0100.3 84.77,92.71 85.72,91.76 94.93,91.76 IC5.13
N$41
  Bottom 0.254: 0100.4 81.28,96.52 RN5.5 86.04,94.3 98.11,94.3 98.11,89.53 97.79,89.22 87.31,89.22 87.31,87 87.63,86.68 94.93,86.68 IC5.11
N$42
  Top 0.254: RN5.6 82.23,95.57 | 82.23,95.57 0100.5 | IC5.8 86.04,87.31 82.23,87.31 82.23,95.57
N$43
  Top 0.254: RN5.7 85.41,93.03 85.41,99.69 84.45,100.65 80.01,100.65 0100.6
  Bottom 0.254: IC5.6 85.41,98.74 85.41,100.33 0100.6
N$44
  Top 0.254: RN5.8 87.31,92.39 87.31,98.74 | IC5.4 87.31,98.74 | 0100.7 87.31,102.87 87.31,98.74
N$45
  Bottom 0.254: RN5.9 80.96,89.22 78.74,89.22 76.2,91.76 76.2,105.41 0100.8 IC5.2
N$47
  Top 0.254: 0101.1 82.87,63.82 86.04,63.82 86.04,75.25 RN6.2
  Bottom 0.254: IC6.17 92.71,77.47 RN6.2
N$48
  Top 0.254: 0101.2 77.79,65.72 77.79,73.66 79.06,74.93 RN6.3
  Bottom 0.254: IC6.15 92.39,72.71 86.04,72.71 RN6.3
N$49
  Top 0.254: 0101.3 78.42,67.63 78.42,71.75 79.06,72.39 RN6.4
  Bottom 0.254: IC6.13 94.93,65.09 85.72,65.09 84.77,66.04 0101.3
N$50
  Bottom 0.254: 0101.4 80.96,69.53 83.5,69.53 RN6.5 89.85,69.85 92.08,67.63 98.11,67.63 98.11,60.01 IC6.11
N$51
  Top 0.254: RN6.6 0101.5
  Bottom 0.254: IC6.8 88.58,63.82 81.92,63.82 80.64,65.09 78.74,65.09 78.42,65.41 78.42,67.31 RN6.6
N$52  (via drill 0.25)
  Top 0.254: RN6.7 85.41,66.36 v85.41,68.58 85.41,73.03 84.77,73.66 0101.6
  Bottom 0.254: v85.41,68.58 IC6.6
N$53
  Top 0.254: RN6.8 87.31,62.23 87.31,72.07 IC6.4
  Bottom 0.254: 0101.7 80.33,75.88 86.68,75.88 IC6.4
N$54
  Top 0.254: RN6.9 77.15,59.69 77.15,75.88 0101.8
  Bottom 0.254: 0101.8 IC6.2
N$56
  Top 0.254: 0110.1 77.79,36.51 77.79,46.99 79.38,48.58 82.23,48.58 82.23,49.21 RN7.2
  Bottom 0.254: IC7.17 92.71,50.8 RN7.2
N$57
  Top 0.254: 0110.2 78.42,38.42 78.42,45.09 79.38,46.04 82.23,46.04 82.23,46.67 RN7.3
  Bottom 0.254: IC7.15 91.12,41.91 89.53,43.5 87.63,43.5 86.04,45.09 86.04,48.26 RN7.3
N$58
  Bottom 0.254: RN7.4 78.42,45.72 78.42,40.96 0110.3 84.77,39.37 85.72,38.42 89.53,38.42 90.81,37.15 96.2,37.15 IC7.13
N$59  (via drill 0.25)
  Top 0.254: IC7.11 92.71,35.56 v92.71,38.42
  Bottom 0.254: 0110.4 81.28,43.18 RN7.5 86.04,40.96 90.17,40.96 v92.71,38.42
N$60
  Top 0.254: RN7.6 82.23,42.23 | 82.23,42.23 0110.5 | IC7.8 86.04,33.97 82.23,33.97 82.23,42.23
N$61
  Bottom 0.254: RN7.7 83.5,38.42 78.74,38.42 77.79,39.37 77.79,46.99 0110.6 85.41,46.99 85.41,44.77 87.31,42.86 87.95,42.86 IC7.6
N$62
  Top 0.254: RN7.8 87.31,39.05 87.31,45.4 IC7.4
  Bottom 0.254: 0110.7 80.33,49.21 86.68,49.21 IC7.4
N$63
  Top 0.254: RN7.9 77.15,33.02 77.15,49.21 0110.8 IC7.2
N$65
  Top 0.254: 0111.1 78.42,9.21 78.42,23.5 79.06,24.13 RN8.2
  Bottom 0.254: IC8.17 98.11,21.91 98.11,24.45 84.14,24.45 RN8.2
N$66
  Bottom 0.254: 0111.2 77.79,12.38 77.79,21.27 83.5,21.27 RN8.3 86.04,19.37 92.39,19.37 IC8.15
N$67
  Bottom 0.254: 0111.3 78.42,14.29 78.42,19.05 RN8.4 86.04,16.83 91.12,16.83 91.12,15.56 IC8.13
N$68
  Bottom 0.254: 80.96,16.19 81.28,16.51 RN8.5 | 80.96,16.19 0111.4 | IC8.11 90.49,11.11 90.49,16.19 80.96,16.19
N$69
  Top 0.254: RN8.6 0111.5
  Bottom 0.254: IC8.8 88.58,10.48 82.55,10.48 82.23,10.79 82.23,13.97 RN8.6
N$70
  Top 0.254: 0111.6 85.41,20.32 85.41,13.02 RN8.7
  Bottom 0.254: RN8.7 87.63,15.24 IC8.6
N$71
  Top 0.254: RN8.8 87.31,12.38 87.31,18.73 | IC8.4 87.31,18.73 | 0111.7 87.31,22.86 87.31,18.73
N$72
  Top 0.254: RN8.9 77.79,6.35 77.79,23.81 79.38,25.4 0111.8
  Bottom 0.254: 0111.8 IC8.2
N$74
  Top 0.254: 1000.1 118.43,90.49 121.6,90.49 121.6,101.92 RN9.2
  Bottom 0.254: IC9.17 128.27,104.14 RN9.2
N$75
  Bottom 0.254: 1000.2 114.62,91.12 113.98,91.12 113.35,91.76 113.35,101.6 RN9.3 121.6,99.38 127.95,99.38 IC9.15
N$76
  Top 0.254: 1000.3 113.98,94.3 113.98,98.42 114.62,99.06 RN9.4
  Bottom 0.254: IC9.13 130.49,91.76 121.28,91.76 120.33,92.71 1000.3
N$77
  Bottom 0.254: 1000.4 116.84,96.52 RN9.5 121.6,94.3 133.67,94.3 133.67,86.68 IC9.11
N$78
  Top 0.254: RN9.6 1000.5
  Bottom 0.254: IC9.8 124.14,90.49 117.47,90.49 116.2,91.76 114.3,91.76 113.98,92.08 113.98,97.79 1000.5
N$79
  Top 0.254: RN9.7 120.97,93.03 120.97,99.69 120.33,100.33 1000.6
  Bottom 0.254: IC9.6 121.6,98.11 117.79,98.11 1000.6
N$80
  Top 0.254: RN9.8 122.87,88.9 122.87,98.74 IC9.4
  Bottom 0.254: 1000.7 115.89,102.55 122.24,102.55 IC9.4
N$81
  Top 0.254: RN9.9 113.35,86.36 113.35,103.19 1000.8
  Bottom 0.254: 1000.8 IC9.2
N$83
  Top 0.254: 1001.1 113.98,62.55 113.98,76.83 114.94,77.79 119.38,77.79 RN10.2
  Bottom 0.254: IC10.17 128.27,77.47 RN10.2
N$84
  Bottom 0.254: 1001.2 113.35,65.72 113.35,74.93 RN10.3 120.65,74.93 122.87,72.71 127.95,72.71 IC10.15
N$85
  Bottom 0.254: RN10.4 113.98,72.39 113.98,67.63 1001.3 120.33,66.04 121.92,64.45 131.13,64.45 IC10.13
N$86
  Bottom 0.254: 1001.4 116.84,69.85 RN10.5 121.6,67.63 127,67.63 129.54,65.09 133.67,65.09 133.67,60.01 IC10.11
N$87
  Top 0.254: RN10.6 117.79,68.9 | 117.79,68.9 1001.5 | IC10.8 121.6,60.64 117.79,60.64 117.79,68.9
N$88
  Top 0.254: RN10.7 120.97,66.36 120.97,73.03 120.02,73.98 115.57,73.98 1001.6
  Bottom 0.254: IC10.6 120.97,72.07 120.97,73.66 1001.6
N$89
  Top 0.254: RN10.8 122.87,65.72 122.87,72.07 IC10.4
  Bottom 0.254: 1001.7 115.89,75.88 122.24,75.88 IC10.4
N$90
  Bottom 0.254: RN10.9 116.52,62.55 114.3,62.55 111.76,65.09 111.76,78.74 1001.8 IC10.2
N$92
  Top 0.254: 1010.1 112.71,37.15 112.71,47.31 113.98,48.58 117.79,48.58 117.79,49.21 RN11.2
  Bottom 0.254: IC11.17 128.27,50.8 RN11.2
N$93
  Top 0.254: 1010.2 113.35,39.05 113.35,46.99 114.3,47.94 119.38,47.94 RN11.3
  Bottom 0.254: IC11.15 131.13,42.86 128.27,42.86 125.09,46.04 121.6,46.04 RN11.3
N$94
  Top 0.254: 1010.3 113.98,40.96 113.98,45.09 114.62,45.72 RN11.4
  Bottom 0.254: IC11.13 130.49,38.42 121.28,38.42 120.65,39.05 115.89,39.05 1010.3
N$95
  Bottom 0.254: 1010.4 115.89,42.23 118.43,42.23 RN11.5 125.41,43.18 127.64,40.96 134.3,40.96 134.3,33.97 IC11.11
N$96
  Top 0.254: RN11.6 117.79,42.23 | 117.79,42.23 1010.5 | IC11.8 121.6,33.97 117.79,33.97 117.79,42.23
N$97  (via drill 0.25)
  Top 0.254: RN11.7 120.97,39.69 v120.97,41.91 120.97,46.35 120.33,46.99 1010.6
  Bottom 0.254: v120.97,41.91 IC11.6
N$98
  Top 0.254: RN11.8 122.87,39.05 122.87,45.4 IC11.4
  Bottom 0.254: 1010.7 115.89,49.21 122.24,49.21 IC11.4
N$99
  Top 0.254: RN11.9 112.08,33.02 112.08,48.58 1010.8
  Bottom 0.254: 1010.8 IC11.2
N$101
  Top 0.254: 1011.1 113.98,9.21 113.98,23.5 114.62,24.13 RN12.2
  Bottom 0.254: IC12.17 128.27,24.13 RN12.2
N$102
  Bottom 0.254: 1011.2 113.35,12.38 113.35,21.27 119.06,21.27 | IC12.15 126.05,21.27 119.06,21.27 | 119.06,21.27 RN12.3
N$103
  Bottom 0.254: 1011.3 113.98,14.29 113.98,19.05 RN12.4 127.32,19.05 127.32,14.92 IC12.13
N$104
  Bottom 0.254: 1011.4 116.84,16.51 RN12.5 126.68,16.51 126.68,10.48 IC12.11
N$105
  Top 0.254: RN12.6 1011.5
  Bottom 0.254: IC12.8 124.14,10.48 118.11,10.48 117.79,10.79 117.79,13.97 RN12.6
N$106
  Top 0.254: 1011.6 120.97,20.32 120.97,13.02 RN12.7
  Bottom 0.254: RN12.7 123.19,15.24 IC12.6
N$107
  Top 0.254: RN12.8 122.87,12.38 122.87,18.73 | IC12.4 122.87,18.73 | 1011.7 122.87,22.86 122.87,18.73
N$108
  Top 0.254: RN12.9 113.35,6.35 113.35,23.81 114.94,25.4 1011.8
  Bottom 0.254: 1011.8 IC12.2
N$110
  Bottom 0.254: 1100.1 148.27,90.49 148.27,104.14 RN13.2 163.83,104.14 IC13.17
N$111
  Top 0.254: 1100.2 149.54,91.76 149.54,100.97 150.5,101.92 154.94,101.92 RN13.3
  Bottom 0.254: IC13.15 161.29,101.6 RN13.3
N$112
  Bottom 0.254: RN13.4 149.54,99.06 149.54,94.3 1100.3 155.89,92.71 156.84,91.76 166.05,91.76 IC13.13
N$113
  Bottom 0.254: 1100.4 152.4,96.52 RN13.5 157.16,94.3 169.23,94.3 169.23,86.68 IC13.11
N$114
  Top 0.254: RN13.6 153.35,95.57 | 153.35,95.57 1100.5 | IC13.8 157.16,87.31 153.35,87.31 153.35,95.57
N$115
  Bottom 0.254: RN13.7 154.62,91.76 149.86,91.76 148.91,92.71 148.91,100.33 1100.6 156.53,100.33 156.53,98.74 IC13.6
N$116
  Top 0.254: RN13.8 158.43,92.39 158.43,98.74 | IC13.4 158.43,98.74 | 1100.7 158.43,102.87 158.43,98.74
N$117
  Top 0.254: RN13.9 148.91,86.36 148.91,103.19 1100.8 IC13.2
N$119
  Top 0.254: 1101.1 148.91,63.18 148.91,73.66 150.5,75.25 153.35,75.25 153.35,75.88 RN14.2
  Bottom 0.254: IC14.17 163.83,77.47 RN14.2
N$120
  Top 0.254: 1101.2 149.54,65.09 149.54,71.75 150.5,72.71 153.35,72.71 153.35,73.34 RN14.3
  Bottom 0.254: IC14.15 163.51,72.71 158.43,72.71 156.21,74.93 RN14.3
N$121
  Bottom 0.254: RN14.4 149.54,72.39 149.54,67.63 1101.3 155.89,66.04 156.84,66.99 164.15,66.99 IC14.13
N$122
  Bottom 0.254: 1101.4 152.4,69.85 RN14.5 157.16,67.63 169.86,67.63 169.86,60.64 IC14.11
N$123
  Top 0.254: RN14.6 153.35,68.9 | 153.35,68.9 1101.5 | IC14.8 157.16,60.64 153.35,60.64 153.35,68.9
N$124
  Bottom 0.254: RN14.7 154.62,65.09 149.86,65.09 148.91,66.04 148.91,73.66 1101.6 156.53,73.66 156.53,72.07 IC14.6
N$125
  Top 0.254: RN14.8 158.43,65.72 158.43,72.07 IC14.4
  Bottom 0.254: 1101.7 151.45,75.88 157.8,75.88 IC14.4
N$126
  Top 0.254: RN14.9 148.27,59.69 148.27,75.88 1101.8 IC14.2
N$128
  Top 0.254: 1110.1 148.91,36.51 148.91,46.99 150.5,48.58 153.35,48.58 153.35,49.21 RN15.2
  Bottom 0.254: IC15.17 163.83,50.8 RN15.2
N$129
  Bottom 0.254: 1110.2 149.54,38.42 149.54,47.94 154.62,47.94 | IC15.15 161.61,47.94 154.62,47.94 | 154.62,47.94 RN15.3
N$130
  Top 0.254: 1110.3 149.54,40.96 149.54,45.09 150.18,45.72 RN15.4
  Bottom 0.254: IC15.13 166.05,38.42 156.84,38.42 155.89,39.37 1110.3
N$131
  Bottom 0.254: 1110.4 152.4,43.18 RN15.5 157.16,40.96 169.23,40.96 169.23,33.34 IC15.11
N$132
  Top 0.254: RN15.6 153.35,42.23 | 153.35,42.23 1110.5 | IC15.8 157.16,33.97 153.35,33.97 153.35,42.23
N$133
  Top 0.254: RN15.7 156.53,39.69 156.53,46.35 155.89,46.99 1110.6
  Bottom 0.254: IC15.6 157.16,44.77 153.35,44.77 1110.6
N$134
  Top 0.254: RN15.8 158.43,39.05 158.43,45.4 | IC15.4 158.43,45.4 | 1110.7 153.35,51.75 158.43,51.75 158.43,45.4
N$135
  Top 0.254: RN15.9 148.27,33.02 148.27,49.21 1110.8
  Bottom 0.254: 1110.8 IC15.2
N$137
  Top 0.254: 1111.1 148.91,9.84 148.91,22.86 150.18,24.13 RN16.2
  Bottom 0.254: IC16.17 166.05,18.73 166.05,14.29 168.91,14.29 169.86,15.24 169.86,24.45 155.26,24.45 RN16.2
N$138
  Top 0.254: 1111.2 149.54,11.75 149.54,20.95 150.18,21.59 RN16.3
  Bottom 0.254: IC16.15 169.23,16.83 169.23,21.59 RN16.3
N$139
  Bottom 0.254: 1111.3 149.54,14.29 149.54,19.05 RN16.4 162.24,19.05 162.24,15.56 IC16.13
N$140
  Bottom 0.254: 1111.4 152.4,16.51 RN16.5 161.61,16.51 161.61,11.11 IC16.11
N$141
  Top 0.254: RN16.6 1111.5
  Bottom 0.254: IC16.8 159.7,10.48 153.67,10.48 153.35,10.79 153.35,13.97 RN16.6
N$142
  Top 0.254: 1111.6 156.53,20.32 156.53,13.02 RN16.7
  Bottom 0.254: RN16.7 158.75,15.24 IC16.6
N$143
  Top 0.254: RN16.8 158.43,12.38 158.43,18.73 IC16.4
  Bottom 0.254: 1111.7 153.67,20.32 IC16.4
N$144
  Top 0.254: RN16.9 148.27,6.35 148.27,23.18 150.5,25.4 1111.8 IC16.2
SW0  (via drill 0.25)
  Top 0.254: IC17.15 28.26,73.98 v28.26,89.53 | IC1.19 54.93,105.41 54.93,106.36 IC1.1
  Bottom 0.254: v28.26,89.53 35.56,96.84 38.1,96.84 41.59,100.33 41.59,107.95 IC1.1
SW1
  Bottom 0.254: IC17.14 34.61,77.79 41.27,77.79 | 41.27,77.79 44.77,81.28 IC2.1 | IC2.19 62.55,77.15 62.55,72.71 56.52,72.71 53.98,75.25 51.75,75.25 50.48,76.52 46.35,76.52 45.09,77.79 41.27,77.79
SW2  (via drill 0.25)
  Top 0.254: v38.1,67.63 39.37,66.36 v39.37,54.61 | IC3.19 59.37,53.66 v59.37,53.98
  Bottom 0.254: IC17.13 26.99,67.63 v38.1,67.63 | v39.37,54.61 IC3.1 58.74,54.61 v59.37,53.98
SW3  (via drill 0.25)
  Top 0.254: v55.24,26.04 IC4.1 | v30.16,64.14 33.02,61.28 v33.02,29.84
  Bottom 0.254: v55.24,26.04 55.88,25.4 IC4.19 | IC17.12 27.3,64.14 v30.16,64.14 | v33.02,29.84 34.92,27.94 IC4.1
SW4  (via drill 0.25)
  Top 0.254: IC17.11 28.89,64.45 v28.89,99.69 | IC5.19 91.12,105.41 91.12,106.36 89.53,107.95 IC5.1
  Bottom 0.254: v28.89,99.69 38.1,108.9 87.95,108.9 IC5.1
SW5  (via drill 0.25)
  Top 0.254: v32.07,65.09 34.61,67.63 v34.61,78.74 | IC6.19 94.61,80.64 v94.61,80.96
  Bottom 0.254: v32.07,65.09 IC17.10 | v34.61,78.74 38.1,82.23 87.95,82.23 IC6.1 94.3,81.28 v94.61,80.96
SW6  (via drill 0.25)
  Top 0.254: v86.36,57.15 IC7.1 88.9,54.29 v87.63,53.02
  Bottom 0.254: v86.36,57.15 IC17.9 | IC7.19 95.57,53.02 v87.63,53.02
SW7  (via drill 0.25)
  Top 0.254: v23.18,59.37 23.81,58.74 v23.81,33.34 | IC8.1 v87.31,29.53 | v93.98,27.94 IC8.19
  Bottom 0.254: IC17.7 19.37,59.37 v23.18,59.37 | v23.81,33.34 26.04,31.11 51.75,31.11 53.34,29.53 v87.31,29.53 | IC8.1 v93.98,27.94
SW8  (via drill 0.25)
  Top 0.254: IC18.15 24.45,50.48 v24.45,98.42 | IC9.19 129.54,107.95 IC9.1
  Bottom 0.254: v24.45,98.42 36.2,110.17 122.24,110.17 IC9.1
SW9  (via drill 0.25)
  Top 0.254: v33.66,52.7 35.24,54.29 v35.24,82.55 | v123.19,79.69 124.46,80.96 IC10.1
  Bottom 0.254: v33.66,52.7 IC18.14 | v35.24,82.55 35.56,82.87 122.87,82.87 IC10.1 | IC10.19 131.13,79.69 v123.19,79.69
SW10  (via drill 0.25)
  Top 0.254: IC18.13 28.89,45.4 v28.89,55.88 | v123.19,53.02 124.46,54.29 IC11.1
  Bottom 0.254: v28.89,55.88 29.53,56.52 122.56,56.52 IC11.1 | IC11.19 131.13,53.02 v123.19,53.02
SW11  (via drill 0.25)
  Top 0.254: IC12.1 v126.05,26.35
  Bottom 0.254: IC18.12 22.54,36.51 17.78,36.51 17.46,36.2 17.46,30.48 51.44,30.48 53.02,28.89 123.51,28.89 IC12.1 | IC12.19 131.13,26.35 v126.05,26.35
SW12  (via drill 0.25)
  Top 0.254: v38.1,46.04 40.01,47.94 40.01,103.19 45.72,108.9 160.02,108.9 IC13.1
  Bottom 0.254: IC18.11 34.61,46.04 v38.1,46.04 | IC13.19 165.1,107.95 IC13.1
SW13  (via drill 0.25)
  Top 0.254: IC18.10 29.53,38.42 v29.53,78.42
  Bottom 0.254: v29.53,78.42 34.61,83.5 157.8,83.5 159.07,82.23 | IC14.1 159.07,82.23 | IC14.19 167.96,79.06 172.09,79.06 172.4,79.38 172.4,82.23 159.07,82.23
SW14  (via drill 0.25)
  Top 0.254: IC18.9 30.16,36.51 v30.16,55.88 | v125.41,55.88 v120.97,55.88
  Bottom 0.254: v120.97,55.88 v30.16,55.88 | v125.41,55.88 125.73,55.56 159.07,55.56 | IC15.1 159.07,55.56 | IC15.19 167.96,52.39 172.09,52.39 172.4,52.7 172.4,55.56 159.07,55.56
SW15
  Bottom 0.254: IC18.7 20,34.61 34.92,34.61 35.56,35.24 46.35,35.24 47.62,33.97 51.44,33.97 52.7,32.7 57.78,32.7 60.33,30.16 157.8,30.16 159.07,28.89 | IC16.1 159.07,28.89 | IC16.19 167.96,25.72 172.09,25.72 172.4,26.04 172.4,28.89 159.07,28.89
VCC
  Top 0.254: R2.2 171.45,24.13 C16.1 C15.1 C14.1 C13.1 167.64,106.68 | X1.A2 X1.B2 X1.C2 | 167.64,106.68 RN13.1 | IC13.20 167.64,106.68 | X1.A31 X1.B31 X1.C31 | V1.14 25.08,94.93 25.08,76.52 IC17.16 25.08,73.34 25.08,52.39 IC18.16
  Bottom 0.254: C16.1 167.64,26.67 | 167.64,26.67 RN16.1 153.99,27.62 134.94,27.62 | 167.64,26.67 IC16.20 | 134.94,27.62 134.62,27.94 IC12.20 131.13,26.99 119.7,26.99 RN12.1 118.43,27.62 96.52,27.62 | 134.94,27.62 C12.1 | C8.1 96.52,26.67 | 96.52,26.67 RN8.1 82.87,27.62 60.96,27.62 | 96.52,26.67 96.52,27.62 | C4.1 60.96,26.67 | 60.96,26.67 RN4.1 IC21.16 20.32,20.32 X1.C2 | 60.96,26.67 60.96,27.62 | 60.96,27.62 IC4.20 | 96.52,27.62 IC8.20 | C14.1 170.18,81.28 IC14.20 166.69,80.33 155.26,80.33 RN14.1 153.99,80.96 134.94,80.96 | 134.94,80.96 134.62,81.28 IC10.20 131.13,80.33 119.7,80.33 RN10.1 118.43,80.96 96.52,80.96 | 134.94,80.96 C10.1 | 60.96,80.01 C2.1 65.72,80.96 82.87,80.96 RN6.1 96.52,80.01 | 60.96,80.01 RN2.1 | 60.96,80.01 IC2.20 | C6.1 96.52,80.01 | 96.52,80.01 96.52,80.96 | 96.52,80.96 IC6.20 | C9.1 132.08,106.68 | 132.08,106.68 RN9.1 118.43,107.63 96.52,107.63 | 132.08,106.68 132.08,107.63 | 60.96,106.68 C1.1 65.72,107.63 82.87,107.63 RN5.1 96.52,106.68 | 60.96,106.68 RN1.1 | 60.96,106.68 IC1.20 | C5.1 96.52,106.68 | 96.52,106.68 96.52,107.63 | 96.52,107.63 IC5.20 | RN13.1 153.99,107.63 132.08,107.63 | 132.08,107.63 IC9.20 | X1.C31 11.75,95.57 25.72,95.57 V1.14 | C15.1 167.64,53.34 | 167.64,53.34 RN15.1 153.99,54.29 134.94,54.29 | 167.64,53.34 IC15.20 | 134.94,54.29 134.62,54.61 IC11.20 131.13,53.66 119.7,53.66 RN11.1 118.43,54.29 99.38,54.29 | 134.94,54.29 C11.1 | 99.38,54.29 99.06,54.61 IC7.20 95.57,53.66 84.14,53.66 RN7.1 82.87,54.29 61.28,54.29 | 99.38,54.29 C7.1 | 61.28,54.29 62.23,53.34 C3.1 | IC18.16 29.21,53.34 RN3.1 59.69,53.34 IC3.20 61.28,54.29

## Text on the board
tNames: YACC1 MEM-SWITCH V1.0 | 0 | onepagecomputer.com